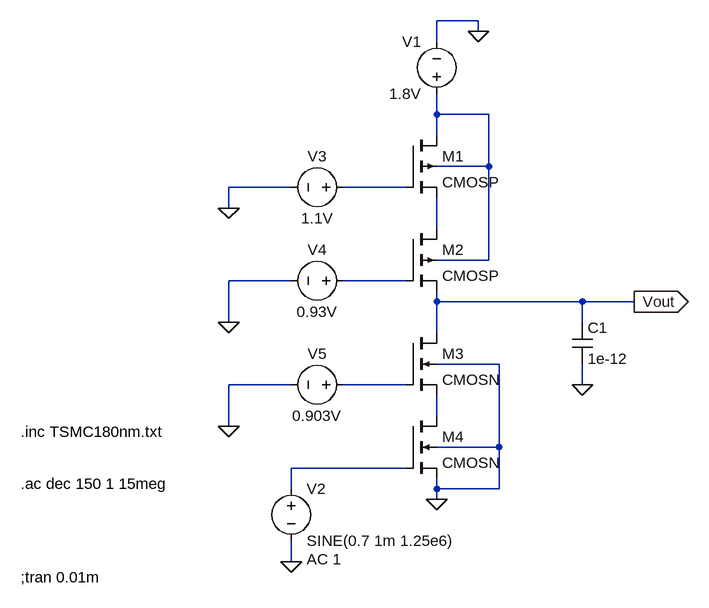
[diagram p0: schematic 3rd.asc]
3rd.asc, the LTspice schematic file:
Version 4
SHEET 1 880 728
WIRE 288 -144 224 -144
WIRE 288 -128 288 -144
WIRE 224 -112 224 -144
WIRE 224 0 224 -32
WIRE 304 0 224 0
WIRE 224 32 224 0
WIRE 304 80 304 0
WIRE 304 80 224 80
WIRE 0 112 -96 112
WIRE 176 112 80 112
WIRE -96 144 -96 112
WIRE 224 176 224 128
WIRE 304 224 304 80
WIRE 304 224 224 224
WIRE 0 256 -96 256
WIRE 176 256 80 256
WIRE 224 288 224 272
WIRE 448 288 224 288
WIRE 528 288 448 288
WIRE -96 320 -96 256
WIRE 448 320 448 288
WIRE 224 336 224 288
WIRE 320 384 224 384
WIRE 0 416 -96 416
WIRE 176 416 80 416
WIRE 448 416 448 384
WIRE 224 464 224 432
WIRE -96 480 -96 416
WIRE 320 512 320 384
WIRE 320 512 224 512
WIRE 176 544 0 544
WIRE 0 576 0 544
WIRE 224 576 224 560
WIRE 320 576 320 512
WIRE 320 576 224 576
WIRE 224 592 224 576
WIRE 0 688 0 656
FLAG 288 -128 0
FLAG 0 688 0
FLAG 448 416 0
FLAG 224 592 0
FLAG -96 144 0
FLAG -96 320 0
FLAG -96 480 0
FLAG 528 288 Vout
IOPIN 528 288 Out
SYMBOL voltage 224 -16 R180
WINDOW 0 24 96 Left 2
WINDOW 3 24 16 Left 2
WINDOW 123 0 0 Left 0
WINDOW 39 0 0 Left 0
SYMATTR InstName V1
SYMATTR Value 1.8V
SYMBOL pmos4 176 32 R0
SYMATTR InstName M1
SYMATTR Value2 l=180n w=3811.32n
SYMATTR Value CMOSP
SYMBOL pmos4 176 176 R0
SYMATTR InstName M2
SYMATTR Value2 l=180n w=3811.32n
SYMATTR Value CMOSP
SYMBOL nmos4 176 336 R0
SYMATTR InstName M3
SYMATTR Value2 l=180n w=770.4n
SYMATTR Value CMOSN
SYMBOL nmos4 176 464 R0
SYMATTR InstName M4
SYMATTR Value2 l=180n w=770.4n
SYMATTR Value CMOSN
SYMBOL voltage 0 560 R0
WINDOW 123 24 124 Left 2
WINDOW 39 0 0 Left 0
SYMATTR Value2 AC 1
SYMATTR InstName V2
SYMATTR Value SINE(0.7 1m 1.25e6)
SYMBOL cap 432 320 R0
SYMATTR InstName C1
SYMATTR Value 1e-12
SYMBOL voltage 96 112 R90
WINDOW 0 -32 56 VBottom 2
WINDOW 3 32 56 VTop 2
WINDOW 123 0 0 Left 0
WINDOW 39 0 0 Left 0
SYMATTR InstName V3
SYMATTR Value 1.1V
SYMBOL voltage 96 256 R90
WINDOW 0 -32 56 VBottom 2
WINDOW 3 32 56 VTop 2
WINDOW 123 0 0 Left 0
WINDOW 39 0 0 Left 0
SYMATTR InstName V4
SYMATTR Value 0.93V
SYMBOL voltage 96 416 R90
WINDOW 0 -32 56 VBottom 2
WINDOW 3 32 56 VTop 2
WINDOW 123 0 0 Left 0
WINDOW 39 0 0 Left 0
SYMATTR InstName V5
SYMATTR Value 0.903V
TEXT -416 488 Left 2 !.inc TSMC180nm.txt
TEXT -416 712 Left 2 !;tran 0.01m
TEXT -416 568 Left 2 !.ac dec 150 1 15meg

The netlist it stands for:
* 3rd.asc
V1 N001 0 1.8V
M1 N001 N002 N003 N001 CMOSP l=180n w=3811.32n
M2 N003 N004 Vout N001 CMOSP l=180n w=3811.32n
M3 Vout N005 N006 0 CMOSN l=180n w=770.4n
M4 N006 N007 0 0 CMOSN l=180n w=770.4n
V2 N007 0 SINE(0.7 1m 1.25e6) AC 1
C1 Vout 0 1e-12
V3 N002 0 1.1V
V4 N004 0 0.93V
V5 N005 0 0.903V
.model NMOS NMOS
.model PMOS PMOS
.lib standard.mos
.inc TSMC180nm.txt
;tran 0.01m
.ac dec 150 1 15meg
.backanno
.end